# Altium schematic sheet USB.SchDoc: USB
size 431 x 279 mm; Author: Alberto Marrone, Christian Schmitz, Leo Walter; DrawnBy: Alberto Marrone, Christian Schmitz, Leo Walter; Engineer: Alberto Marrone, Christian Schmitz, Leo Walter; Revision: V1.0; SheetNumber: 6; Project: PCB Design Final Project
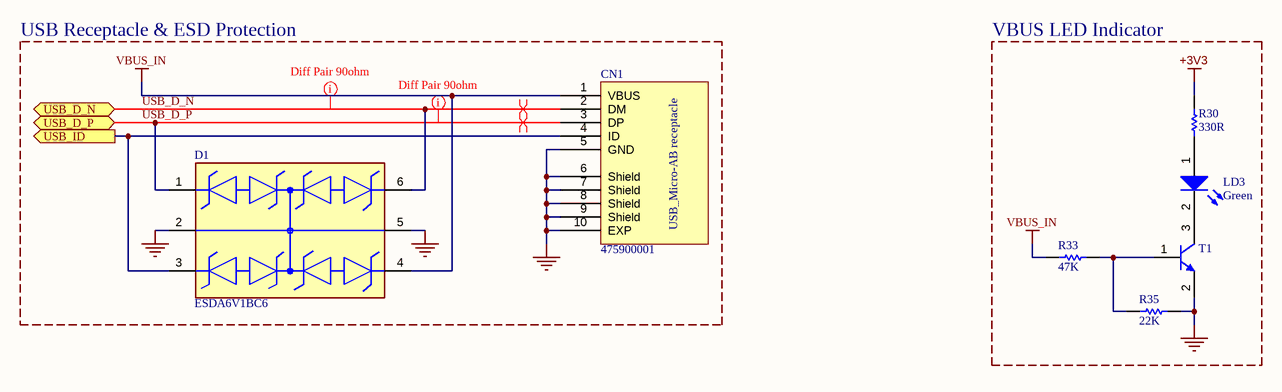
[diagram p0: USB.SchDoc]

## Parts
CN1  475900001  [MOLEX_47590001]
D1  ESDA6V1BC6  [FP-SOT23-6L-MFG]
LD3  Green  [0603D-G]
R30  330R  [0603R]
R33  47K  [0603R]
R35  22K  [0603R]
T1  MMBTA05LT3G  [SOT-23]  (value not drawn)

## Blocks framed on the sheet
USB Receptacle & ESD Protection: CN1 D1
VBUS LED Indicator: LD3 R30 R33 R35 T1

## Ports
USB_D_N (bidir), USB_D_P (bidir), USB_ID (out)

## Nets
+3V3: R30.2
GND: CN1.5(GND) CN1.6(Shield) CN1.7(Shield) CN1.8(Shield) CN1.9(Shield) CN1.10(EXP) D1.2 D1.5 R35.1 T1.2(E)
VBUS_IN: CN1.1(VBUS) D1.4 R33.1
USB_D_N: CN1.2(DM) D1.6 ; port USB_D_N
USB_D_P: CN1.3(DP) D1.1 ; port USB_D_P
USB_ID: CN1.4(ID) D1.3 ; port USB_ID
NetLD3_1: LD3.1(A) R30.1
NetLD3_2: LD3.2(K) T1.3(C)
NetR33_2: R33.2 R35.2 T1.1(B)

## Layout directives
net class USB_HighSpeed: USB_D_N, USB_D_P
differential pair: USB_D_N, USB_D_P

## Notes on the sheet
- DWG. NO.
- REV.
- SHT.
- THIS DOCUMENT AND THE DATA DISCLOSED HEREIN OR HEREWITH IS THE PROPERTY OF ALTIUM LIMITED AND MAY BE FREELY DISTRIBUTED IN WHOLE. NO RIGHTS ARE RESERVED OR EXPRESS OR IMPLIED WARANTEE GIVEN.
- REVISION
- DESCRIPTION
- DATE
- APPROVED
- ENG:
- APPROVALS
- PROJECT
- DSN:
- CHK:
- REFERENCE DOCUMENTS
- PROJECT REVISION:
- TITLE
- DOCUMENT REVISION:
- DESIGN ITEM:
- BOM:
- FAB DWG:
- PCB DWG:
- ASSY DWG:
- SCALE:
- SIZE
- B
- CAGE CODE
- FILE NAME
- DWG NO.
- SHEET
- OF
- REV
- (in symbol 475900001) USB_Micro-AB receptacle

## Library data of the parts
D1 = CMP-12225-000005-1: TVS DIODE 5V SOT23-6; Manufacturer: STMicroelectronics; Direction: Bidirectional; Capacitance: 20p; Standoff Height: 0mm; Number Of Channels: 4; Peak Pulse Power: 80W; Max Junction Temp: +150°C; Breakdown Voltage: 6.1V; Peak Pulse Current: 3A; Category: Diode; Manufacturer Part Number: ESDA6V1BC6; Digikey Description: TVS DIODE 5V SOT23-6; Temperature Range High: +125°C; Ipc Land Pattern Name: SOT95P280X118-6; Device Class L3: unset; Temperature Range Low: -40°C; ComponentLink2Description: Datasheet; Automotive: No; Device Class L1: Circuit Protection; Mouser Description: TVS Diodes / ESD Suppressors 6.1V 80W Bidirect; Temperature: -40°C to +125°C; Reverse Standoff Voltage: 5V; ComponentLink2URL: https://www.st.com/resource/en/datasheet/esda6v1bc6.pdf; Package: SOT23-6L; Device Class L2: TVS Diodes; Lead Free: Yes; RoHS: TRUE; Octopart: https://octopart.com/esda6v1bc6-stmicroelectronics-347715; Height: 1.45mm
LD3 = LED2: Typical RED, GREEN, YELLOW, AMBER GaAs LED; Published: 8-Jun-2000; Revision: July-2002: Re-released for DXP Platform.; Publisher: Altium Limited
R30 = Res1: Resistor; Published: 8-Jun-2000; Revision: July-2002: Re-released for DXP Platform.; Publisher: Altium Limited; Value: 330R
R33 R35 = res1: Resistor; Published: 8-Jun-2000; Revision: July-2002: Re-released for DXP Platform.; Publisher: Altium Limited
  R33: Value: 47K
  R35: Value: 22K
T1 = NPN: NPN Bipolar Transistor; Code - JEDEC: TO-226-AA; Published: 8-Jun-2000; Revision: July-2002: Re-released for DXP Platform.; Publisher: Altium Limited